# Altium schematic sheet 单路驱动.SchDoc
size A4
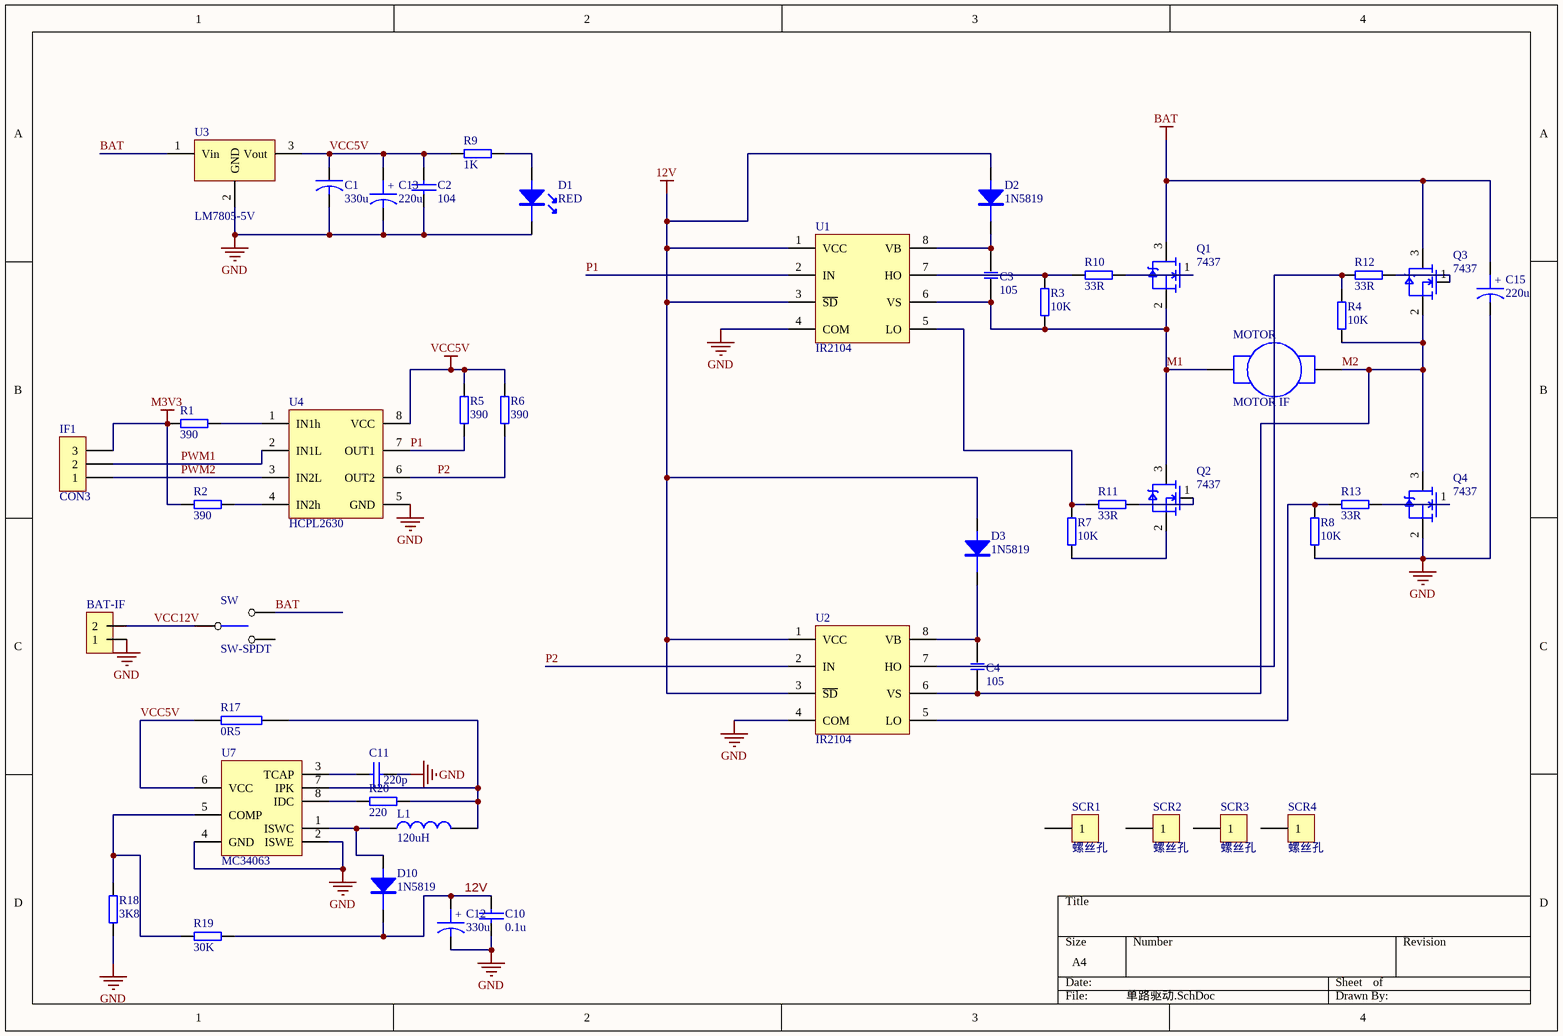
[diagram p0: 单路驱动.SchDoc]

## Parts
BAT-IF  LQ_PIN2  [LQ_PIN2]  (value not drawn)
C1  330u  [LQ_7343D]
C2  104  [LQ_0603]
C3  105  [LQ_0603]
C4  105  [LQ_0603]
C10  0.1u  [LQ_0603]
C11  220p  [LQ_0603]
C12  330u  [LQ_220U16V]
C13  220u  [LQ_220U16V]
C15  220u  [LQ_220U16V]
D1  RED  [LQ_0603D]
D2  1N5819  [LQ_1206]
D3  1N5819  [LQ_1206]
D10  1N5819  [LQ_1206]
IF1  CON3  [Pin HDR1X3/2.54mm-S]
L1  120uH  [LQ_1210]
MOTOR  MOTOR IF  [LQ_PIN2]
Q1  7437  [LQ_DPAK123]
Q2  7437  [LQ_DPAK123]
Q3  7437  [LQ_DPAK123]
Q4  7437  [LQ_DPAK123]
R1  390  [LQ_0603]
R2  390  [LQ_0603]
R3  10K  [LQ_0603]
R4  10K  [LQ_0603]
R5  390  [LQ_0603]
R6  390  [LQ_0603]
R7  10K  [LQ_0603]
R8  10K  [LQ_0603]
R9  1K  [LQ_0603]
R10  33R  [LQ_0603]
R11  33R  [LQ_0603]
R12  33R  [LQ_0603]
R13  33R  [LQ_0603]
R17  0R5  [LQ_0805]
R18  3K8  [LQ_R0603]
R19  30K  [LQ_R0603]
R20  220  [LQ_0603]
SCR1  螺丝孔  [LQ_SCROW3&5mm]
SCR2  螺丝孔  [LQ_SCROW3&5mm]
SCR3  螺丝孔  [LQ_SCROW3&5mm]
SCR4  螺丝孔  [LQ_SCROW3&5mm]
SW  SW-SPDT  [LQ_SWSIP3]
U1  IR2104  [SO-8]
U2  IR2104  [SO-8]
U3  LM7805-5V  [LQ_DPAK]
U4  HCPL2630  [DIP8]
U7  MC34063  [SO-8]

## Nets
12V: C10.1 C12.1 D2.2 D3.2 D10.1 R19.2 U1.1(VCC) U1.3(~{SD}) U2.1(VCC) U2.3(~{SD})
BAT: C15.1 Q1.3(D) Q3.3(D) SW.2 U3.1(Vin)
GND: BAT-IF.1 C1.2 C2.2 C10.2 C11.2 C12.2 C13.2 C15.2 D1.2 Q4.2(S) R8.2 R18.2 U1.4(COM) U2.4(COM) U3.2(GND) U4.5(GND) U7.2(ISWE) U7.4(GND)
M3V3: IF1.3 R1.1 R2.1
VCC5V: C1.1 C2.1 C13.1 R5.1 R6.1 R9.1 R17.1 U3.3(Vout) U4.8(VCC) U7.6(VCC)
M1: C3.2 MOTOR.1 Q1.2(S) Q2.3(D) R3.2 U1.6(VS)
M2: C4.2 MOTOR.2 Q3.2(S) Q4.3(D) R4.2 U2.6(VS)
P1: R5.2 U1.2(IN) U4.7(OUT1)
P2: R6.2 U2.2(IN) U4.6(OUT2)
PWM1: IF1.2 U4.2(IN1L)
PWM2: IF1.1 U4.3(IN2L)
VCC12V: BAT-IF.2 SW.1
NetC3_1: C3.1 D2.1 U1.8(VB)
NetC4_1: C4.1 D3.1 U2.8(VB)
NetC11_1: C11.1 U7.3(TCAP)
NetD1_1: D1.1 R9.2
NetD10_2: D10.2 L1.1 U7.1(ISWC)
NetL1_2: L1.2 R17.2 R20.2 U7.7(IPK)
NetQ1_1: Q1.1(G) R10.2
NetQ2_1: Q2.1(G) R11.2
NetQ2_2: Q2.2(S) R7.2
NetQ3_1: Q3.1(G) R12.2
NetQ4_1: Q4.1(G) R13.2
NetR1_2: R1.2 U4.1(IN1h)
NetR2_2: R2.2 U4.4(IN2h)
NetR3_1: R3.1 R10.1 U1.7(HO)
NetR4_1: R4.1 R12.1 U2.7(HO)
NetR7_1: R7.1 R11.1 U1.5(LO)
NetR8_1: R8.1 R13.1 U2.5(LO)
NetR18_1: R18.1 R19.1 U7.5(COMP)
NetR20_1: R20.1 U7.8(IDC)

Not connected (* = marked no-connect by the designer): SCR1 1; SCR2 1; SCR3 1; SCR4 1; SW 3

## Notes on the sheet
- (in symbol LQ_CAP_POL) +

## Library data of the parts
BAT-IF = LQ_PIN2: Jumper
C1 = CAPACITOR
C2 C10 C11 = CAP: Capacitor
C3 C4 = LQ_CAP: CAP
C12 C13 C15 = LQ_CAP_POL: 10u
D1 = LQ_LED
D2 D3 D10 = LQ_DIODE
IF1 = Pin HDR1X3
L1 = INDUCTOR
MOTOR = MOTOR AC
Q1-Q4 = BSS138N
R1-R13 R18-R20 = LQ_RES: RES
R17 = RES2
SCR1-SCR4 = CON1: Connector
U3 = LM7805
U4 = HCPL2630: 6N137 2631